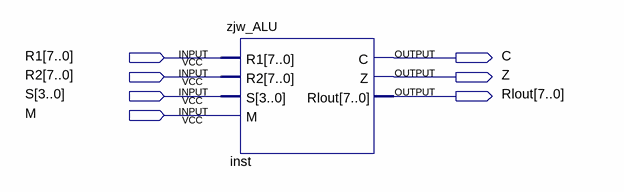
[diagram p0: schematic sheet]
// Quartus schematic Block1.bdf as structural Verilog: 1 symbols, 7 pins
module Block1 (
  input  [7:0] R1,
  input  [7:0] R2,
  input  [3:0] S,
  input  M,
  output C,
  output Z,
  output [7:0] Rlout
);

  zjw_ALU inst (.R1(R1), .R2(R2), .S(S), .M(M), .C(C), .Z(Z), .Rlout(Rlout));
endmodule
